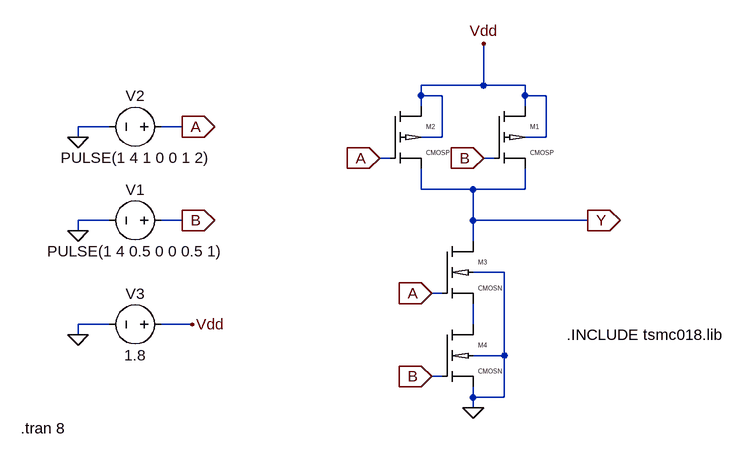
[diagram p0: schematic NAND-2_in.asc]
NAND-2_in.asc, the LTspice schematic file:
Version 4
SHEET 1 880 680
WIRE 320 16 320 -48
WIRE 320 16 224 16
WIRE 384 16 320 16
WIRE 224 32 224 16
WIRE 256 32 224 32
WIRE 384 32 384 16
WIRE 416 32 384 32
WIRE 224 48 224 32
WIRE 384 48 384 32
WIRE -256 80 -304 80
WIRE -144 80 -176 80
WIRE -304 96 -304 80
WIRE 256 96 256 32
WIRE 256 96 224 96
WIRE 416 96 416 32
WIRE 416 96 384 96
WIRE 176 128 160 128
WIRE 336 128 320 128
WIRE 224 176 224 144
WIRE 304 176 224 176
WIRE 384 176 384 144
WIRE 384 176 304 176
WIRE -256 224 -304 224
WIRE -144 224 -176 224
WIRE 304 224 304 176
WIRE 480 224 304 224
WIRE -304 240 -304 224
WIRE 304 256 304 224
WIRE 352 304 304 304
WIRE 256 336 240 336
WIRE -256 384 -304 384
WIRE -128 384 -176 384
WIRE 304 384 304 352
WIRE -304 400 -304 384
WIRE 352 432 352 304
WIRE 352 432 304 432
WIRE 256 464 240 464
WIRE 304 496 304 480
WIRE 352 496 352 432
WIRE 352 496 304 496
WIRE 304 512 304 496
FLAG 304 512 0
FLAG 160 128 A
IOPIN 160 128 In
FLAG 240 336 A
IOPIN 240 336 In
FLAG 320 128 B
IOPIN 320 128 In
FLAG 240 464 B
IOPIN 240 464 In
FLAG 480 224 Y
IOPIN 480 224 Out
FLAG 320 -48 Vdd
FLAG -144 80 A
IOPIN -144 80 Out
FLAG -144 224 B
IOPIN -144 224 Out
FLAG -304 96 0
FLAG -304 240 0
FLAG -304 400 0
FLAG -128 384 Vdd
SYMBOL Pcmos 336 48 R0
SYMATTR InstName M1
SYMBOL Pcmos 176 48 R0
SYMATTR InstName M2
SYMBOL Ncmos 256 256 R0
SYMATTR InstName M3
SYMBOL Ncmos 256 384 R0
SYMATTR InstName M4
SYMBOL voltage -160 224 R90
WINDOW 0 -32 56 VBottom 2
WINDOW 3 32 56 VTop 2
WINDOW 123 0 0 Left 0
WINDOW 39 0 0 Left 0
SYMATTR InstName V1
SYMATTR Value PULSE(1 4 0.5 0 0 0.5 1)
SYMBOL voltage -160 80 R90
WINDOW 0 -32 56 VBottom 2
WINDOW 3 32 56 VTop 2
WINDOW 123 0 0 Left 0
WINDOW 39 0 0 Left 0
SYMATTR InstName V2
SYMATTR Value PULSE(1 4 1 0 0 1 2)
SYMBOL voltage -160 384 R90
WINDOW 0 -32 56 VBottom 2
WINDOW 3 32 56 VTop 2
WINDOW 123 0 0 Left 0
WINDOW 39 0 0 Left 0
SYMATTR InstName V3
SYMATTR Value 1.8
TEXT 448 400 Left 2 !.INCLUDE tsmc018.lib
TEXT -392 544 Left 2 !.tran 8

The netlist it stands for:
* NAND-2_in.asc
M1 Vdd B Y Vdd CMOSP
M2 Vdd A Y Vdd CMOSP
M3 Y A N001 0 CMOSN
M4 N001 B 0 0 CMOSN
V1 B 0 PULSE(1 4 0.5 0 0 0.5 1)
V2 A 0 PULSE(1 4 1 0 0 1 2)
V3 Vdd 0 1.8
.model NMOS NMOS
.model PMOS PMOS
.lib standard.mos
.INCLUDE tsmc018.lib
.tran 8
.lib tsmc018.lib
.backanno
.end